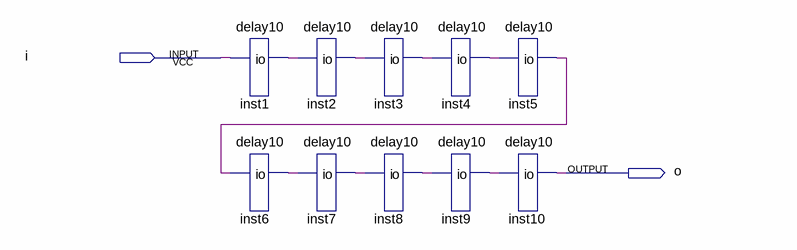
[diagram p0: schematic sheet]
// Quartus schematic delay100.bdf as structural Verilog: 10 symbols, 2 pins
module delay100 (
  input  i,
  output o
);

  wire inst1_o, inst2_o, inst3_o, inst4_o, inst5_o, inst6_o, inst7_o, inst8_o, inst9_o;

  delay10 inst1 (.i(i), .o(inst1_o));
  delay10 inst6 (.i(inst5_o), .o(inst6_o));
  delay10 inst2 (.i(inst1_o), .o(inst2_o));
  delay10 inst7 (.i(inst6_o), .o(inst7_o));
  delay10 inst3 (.i(inst2_o), .o(inst3_o));
  delay10 inst8 (.i(inst7_o), .o(inst8_o));
  delay10 inst4 (.i(inst3_o), .o(inst4_o));
  delay10 inst9 (.i(inst8_o), .o(inst9_o));
  delay10 inst5 (.i(inst4_o), .o(inst5_o));
  delay10 inst10 (.i(inst9_o), .o(o));
endmodule
